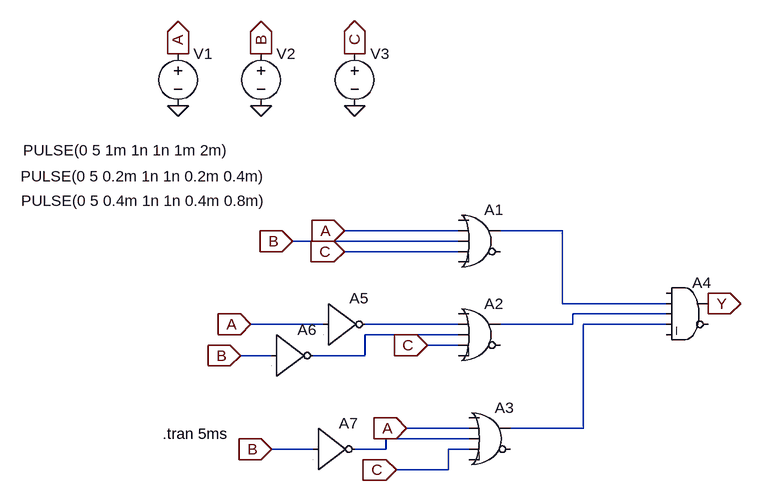
[diagram p0: schematic POS.asc]
POS.asc, the LTspice schematic file:
Version 4
SHEET 1 880 680
WIRE 160 32 -16 32
WIRE 320 32 224 32
WIRE 160 48 -96 48
WIRE 160 64 -16 64
WIRE 320 144 320 32
WIRE 480 144 320 144
WIRE 480 160 336 160
WIRE -48 176 -160 176
WIRE 160 176 16 176
WIRE 336 176 336 160
WIRE 336 176 224 176
WIRE 480 176 352 176
WIRE 160 192 16 192
WIRE 160 208 112 208
WIRE -128 224 -176 224
WIRE 16 224 16 192
WIRE 16 224 -64 224
WIRE 176 336 80 336
WIRE 352 336 352 176
WIRE 352 336 240 336
WIRE 176 352 48 352
WIRE -64 368 -128 368
WIRE 48 368 48 352
WIRE 48 368 0 368
WIRE 176 368 144 368
WIRE 144 400 144 368
WIRE 144 400 64 400
FLAG -16 32 A
IOPIN -16 32 In
FLAG -96 48 B
IOPIN -96 48 In
FLAG -16 64 C
IOPIN -16 64 In
FLAG -160 176 A
IOPIN -160 176 In
FLAG -176 224 B
IOPIN -176 224 In
FLAG 112 208 C
IOPIN 112 208 In
FLAG 80 336 A
IOPIN 80 336 In
FLAG -128 368 B
IOPIN -128 368 In
FLAG 64 400 C
IOPIN 64 400 In
FLAG 544 144 Y
IOPIN 544 144 Out
FLAG 0 -160 0
FLAG -144 -160 0
FLAG -272 -160 0
FLAG -272 -240 A
IOPIN -272 -240 Out
FLAG -144 -240 B
IOPIN -144 -240 Out
FLAG 0 -240 C
IOPIN 0 -240 Out
SYMBOL Digital\\or 192 -16 R0
SYMATTR InstName A1
SYMBOL Digital\\or 192 128 R0
SYMATTR InstName A2
SYMBOL Digital\\or 208 288 R0
SYMATTR InstName A3
SYMBOL Digital\\and 512 96 R0
SYMATTR InstName A4
SYMBOL Digital\\inv -48 112 R0
SYMATTR InstName A5
SYMBOL Digital\\inv -128 160 R0
SYMATTR InstName A6
SYMBOL Digital\\inv -64 304 R0
SYMATTR InstName A7
SYMBOL voltage -272 -256 R0
WINDOW 3 -238 164 Left 2
WINDOW 123 0 0 Left 0
WINDOW 39 0 0 Left 0
SYMATTR InstName V1
SYMATTR Value PULSE(0 5 1m 1n 1n 1m 2m)
SYMBOL voltage -144 -256 R0
WINDOW 3 -370 204 Left 2
WINDOW 123 0 0 Left 0
WINDOW 39 0 0 Left 0
SYMATTR InstName V2
SYMATTR Value PULSE(0 5 0.2m 1n 1n 0.2m 0.4m)
SYMBOL voltage 0 -256 R0
WINDOW 3 -513 242 Left 2
WINDOW 123 0 0 Left 0
WINDOW 39 0 0 Left 0
SYMATTR InstName V3
SYMATTR Value PULSE(0 5 0.4m 1n 1n 0.4m 0.8m)
TEXT -296 344 Left 2 !.tran 5ms

The netlist it stands for:
* POS.asc
A1 0 A B C 0 0 N001 0 OR
A2 0 N003 N005 C 0 0 N002 0 OR
A3 0 A N006 C 0 0 N004 0 OR
A4 0 N001 N002 N004 0 0 Y 0 AND
A5 A 0 0 0 0 N003 0 0 BUF
A6 B 0 0 0 0 N005 0 0 BUF
A7 B 0 0 0 0 N006 0 0 BUF
V1 A 0 PULSE(0 5 1m 1n 1n 1m 2m)
V2 B 0 PULSE(0 5 0.2m 1n 1n 0.2m 0.4m)
V3 C 0 PULSE(0 5 0.4m 1n 1n 0.4m 0.8m)
.tran 5ms
.backanno
.end

* Results of the author's LTspice run, read from the files saved beside the schematic
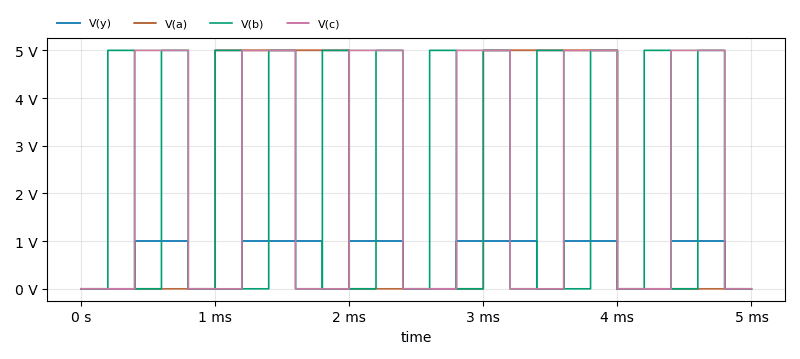
[diagram p1: Transient Analysis of POS.asc, plotted from the saved traces]
* Transient Analysis, 1 run:
*   V(y): min 0 V, max 1 V, average 560 mV, rms 748.3 mV, last 0 V
*   V(a): min 0 V, max 5 V, average 2 V, rms 3.162 V, last 0 V
*   V(b): min 0 V, max 5 V, average 2.4 V, rms 3.464 V, last 0 V
*   V(c): min 0 V, max 5 V, average 2.4 V, rms 3.464 V, last 0 V